# EAGLE design Amp-Rev1 (EAGLE 7.6.0)
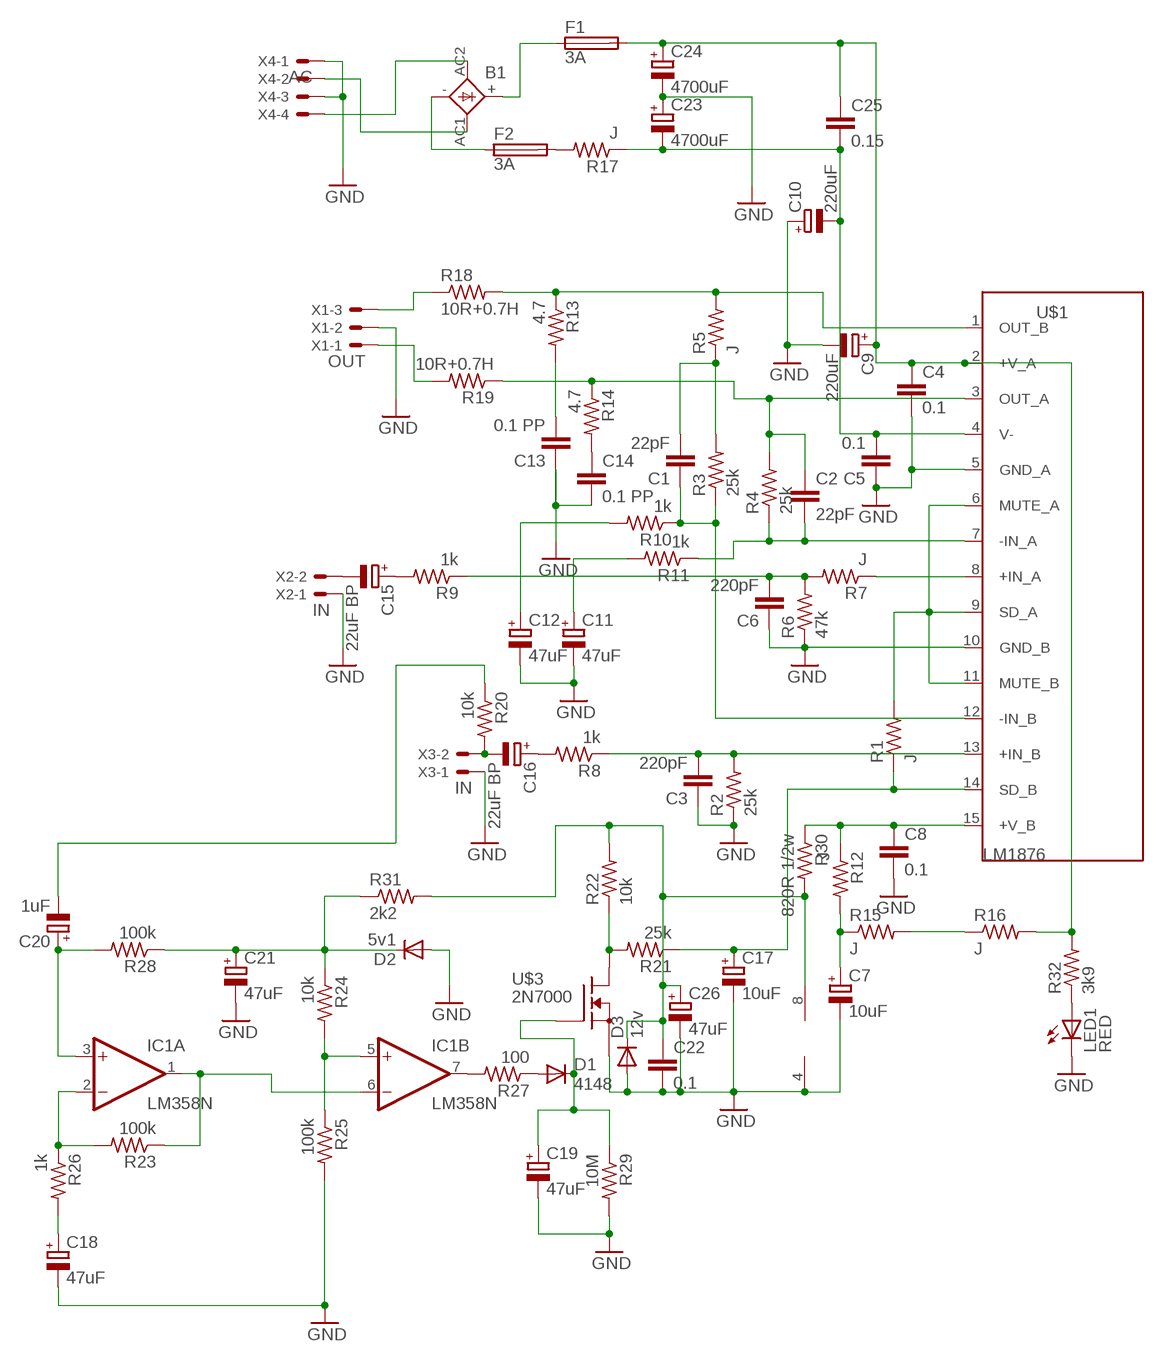
[diagram p0: schematic, sheet 1]

## Parts
B1  GBU4  [GBU4S]
C1  22pF  C-EU075-032X103  [C075-032X103]
C2  22pF  C-EU075-032X103  [C075-032X103]
C3  220pF  C-EUC1210  [C1210]
C4  0.1  C-EU050-025X075  [C050-025X075]
C5  0.1  C-EU050-025X075  [C050-025X075]
C6  220pF  C-EUC1210  [C1210]
C7  10uF  CPOL-EUE2.5-7  [E2,5-7]
C8  0.1  C-EU050-025X075  [C050-025X075]
C9  220uF  CPOL-EUE5-8.5  [E5-8,5]
C10  220uF  CPOL-EUE5-8.5  [E5-8,5]
C11  47uF  CPOL-EUE2.5-7  [E2,5-7]
C12  47uF  CPOL-EUE2.5-7  [E2,5-7]
C13  0.1 PP  C-EU050-055X075  [C050-055X075]
C14  0.1 PP  C-EU050-055X075  [C050-055X075]
C15  22uF BP  CPOL-EUE2.5-7  [E2,5-7]
C16  22uF BP  CPOL-EUE2.5-7  [E2,5-7]
C17  10uF  CPOL-EUE2.5-6  [E2,5-6]
C18  47uF  CPOL-EUE2.5-7  [E2,5-7]
C19  47uF  CPOL-EUE2.5-7  [E2,5-7]
C20  1uF  CPOL-EUE2.5-6  [E2,5-6]
C21  47uF  CPOL-EUE2.5-7  [E2,5-7]
C22  0.1  C-EUC1206  [C1206]
C23  4700uF  CPOL-EUE7.5-16  [E7,5-16]
C24  4700uF  CPOL-EUE7.5-16  [E7,5-16]
C25  0.15  C-EU075-032X103  [C075-032X103]
C26  47uF  CPOL-EUE2.5-7  [E2,5-7]
D1  4148  1N4148DO35-7  [DO35-7]
D2  5v1  1N4148DO35-10  [DO35-10]
D3  12v  1N4148DO35-10  [DO35-10]
F1  3A  19560  [19560]
F2  3A  19560  [19560]
IC1  LM358N  [DIL08]
LED1  RED  TLLR4400  [LED3MM]
R1  J  R-US_0207/12  [0207/12]
R2  25k  R-US_R1210  [R1210]
R3  25k  R-US_0207/10  [0207/10]
R4  25k  R-US_0207/10  [0207/10]
R5  J  R-US_0207/10  [0207/10]
R6  47k  R-US_M1206  [M1206]
R7  J  R-US_0204/7  [0204/7]
R8  1k  R-US_0207/10  [0207/10]
R9  1k  R-US_0207/12  [0207/12]
R10  1k  R-US_0204/7  [0204/7]
R11  1k  R-US_0207/10  [0207/10]
R12  J  R-US_0207/12  [0207/12]
R13  4.7  R-US_0207/12  [0207/12]
R14  4.7  R-US_0207/12  [0207/12]
R15  J  R-US_0207/12  [0207/12]
R16  J  R-US_0207/12  [0207/12]
R17  J  R-US_0207/10  [0207/10]
R18  10R+0.7H  R-US_0207/12  [0207/12]
R19  10R+0.7H  R-US_0207/12  [0207/12]
R20  10k  R-US_0204/7  [0204/7]
R21  25k  R-US_0204/7  [0204/7]
R22  10k  R-US_0204/7  [0204/7]
R23  100k  R-US_0204/5  [0204/5]
R24  10k  R-US_0207/10  [0207/10]
R25  100k  R-US_0204/5  [0204/5]
R26  1k  R-US_0207/10  [0207/10]
R27  100  R-US_0204/7  [0204/7]
R28  100k  R-US_0204/5  [0204/5]
R29  10M  R-US_0207/10  [0207/10]
R30  820R 1/2w  R-US_0207/10  [0207/10]
R31  2k2  R-US_0309/10  [0309/10]
R32  3k9  R-US_0207/10  [0207/10]
U$1  LM1876  [MULTIWATT-15]
U$3  2N7000  [TO92-]
X1  OUT  22-23-2031  [22-23-2031]
X2  IN  22-23-2021  [22-23-2021]
X3  IN  22-23-2021  [22-23-2021]
X4  AC  5566-4  [5566-4]

## Nets
GND: C3.1 C4.2 C5.1 C6.1 C7.- C8.2 C9.- C10.+ C11.- C12.- C13.1 C14.2 C17.- C18.- C19.- C21.- C22.2 C23.+ C24.- C26.- D2.A D3.A IC1.4(P:V-) LED1.K(C) R2.1 R6.1 R25.2 R29.2 U$1.5(GND_A) U$1.10(GND_B) U$3.3(S) X1.2 X2.1 X3.1 X4.1 X4.3
N$1: R7.1 U$1.8(+IN_A)
N$2: R1.2 U$1.6(MUTE_A) U$1.9(SD_A) U$1.11(MUTE_B)
N$3: C1.2 R3.2 R5.1
N$4: C6.2 R6.2 R7.2 R9.1
N$5: C2.2 R4.1 R11.1 U$1.7(-IN_A)
N$6: C5.2 C10.- C23.- C25.2 R17.1 U$1.4(V-)
N$7: C2.1 R4.2 R14.1 R19.1 U$1.3(OUT_A)
N$8: C4.1 C9.+ C24.+ C25.1 F1.2 R16.2 R32.2 U$1.2(+V_A)
N$9: R5.2 R13.1 R18.2 U$1.1(OUT_B)
N$10: C1.1 R3.1 R10.1 U$1.12(-IN_B)
N$11: R15.2 R16.1
N$12: C22.1 C26.+ D3.C IC1.8(P:V+) R22.2 R30.2 R31.2
N$13: C7.+ R12.2 R15.1
N$15: C17.+ R1.1 R21.1 U$1.14(SD_B)
N$17: C12.+ R10.2
N$18: C11.+ R11.2
N$19: C3.2 R2.2 R8.1 U$1.13(+IN_B)
N$21: C13.2 R13.2
N$22: C14.1 R14.2
N$23: R18.1 X1.3
N$24: R19.2 X1.1
N$25: C15.+ R9.2
N$26: C15.- X2.2
N$27: C20.- R20.1
N$28: C16.+ R8.2
N$29: C16.- R20.2 X3.2
N$30: LED1.A R32.1
N$31: C19.+ D1.C R29.1 U$3.2(G)
N$32: IC1.2(A:-IN) R23.2 R26.1
N$33: IC1.1(A:OUT) IC1.6(B:-IN) R23.1
N$34: C20.+ IC1.3(A:+IN) R28.2
N$35: IC1.5(B:+IN) R24.2 R25.1
N$36: C18.+ R26.2
N$37: C8.1 R12.1 R30.1 U$1.15(+V_B)
N$38: IC1.7(B:OUT) R27.2
N$39: C21.+ D2.C R24.1 R28.1 R31.1
N$40: R21.2 R22.1 U$3.1(D)
N$42: D1.A R27.1
N$46: B1.+ F1.1
N$47: F2.2 R17.2
N$48: B1.- F2.1
N$49: B1.AC1(AC2) X4.2
N$51: B1.AC2(AC1) X4.4

## Library data of the parts
B1 = rectifier:GBU4: GENERAL INSTRUMENT RECTIFIER
C1-C6 C8 C13 C14 C22 C25 = resistor:C-EU: CAPACITOR, European symbol
C7 C9-C12 C15-C21 C23 C24 C26 = resistor:CPOL-EU: POLARIZED CAPACITOR, European symbol
D1-D3 = diode:1N4148: DIODE high speed (Philips)
F1 F2 = fuse:19560: FUSE HOLDER TR5, Wickmann; MPN: 56000001009; OC_FARNELL: 1185363; OC_NEWARK: 15P8392
IC1 = linear:LM358: OP AMP also LM158; LM258; LM2904 Source: http://cache.national.com/ds/LM/LM158.pdf
LED1 = led:TLLR4400: Low Current (2mA) LED 3 mm Tinted Diffused Package color RED Source: Data sheet <http://www.farnell.com/datasheets/391100.pdf>; MF: VISHAY SEMICONDUCTOR; OC_FARNELL: 1612437
R1-R32 = resistor:R-US_: RESISTOR, American symbol
U$1 = st-microelectronics:LM1876: LM1876 2x15watt Audio Amplifer
U$3 = transistor-fet:2N7000
X1 = con-molex:22-23-2031: .100" (2.54mm) Center Header - 3 Pin; MF: MOLEX; MPN: 22-23-2031; OC_FARNELL: 1462950; OC_NEWARK: 30C0862
X2 X3 = con-molex:22-23-2021: .100" (2.54mm) Center Header - 2 Pin; MF: MOLEX; MPN: 22-23-2021; OC_FARNELL: 1462926; OC_NEWARK: 25C3832
X4 = con-molex:5566-4: Mini FIT connector 4 pol Source: http://www.molex.com; OC_FARNELL: unknown; OC_NEWARK: unknown

## Board
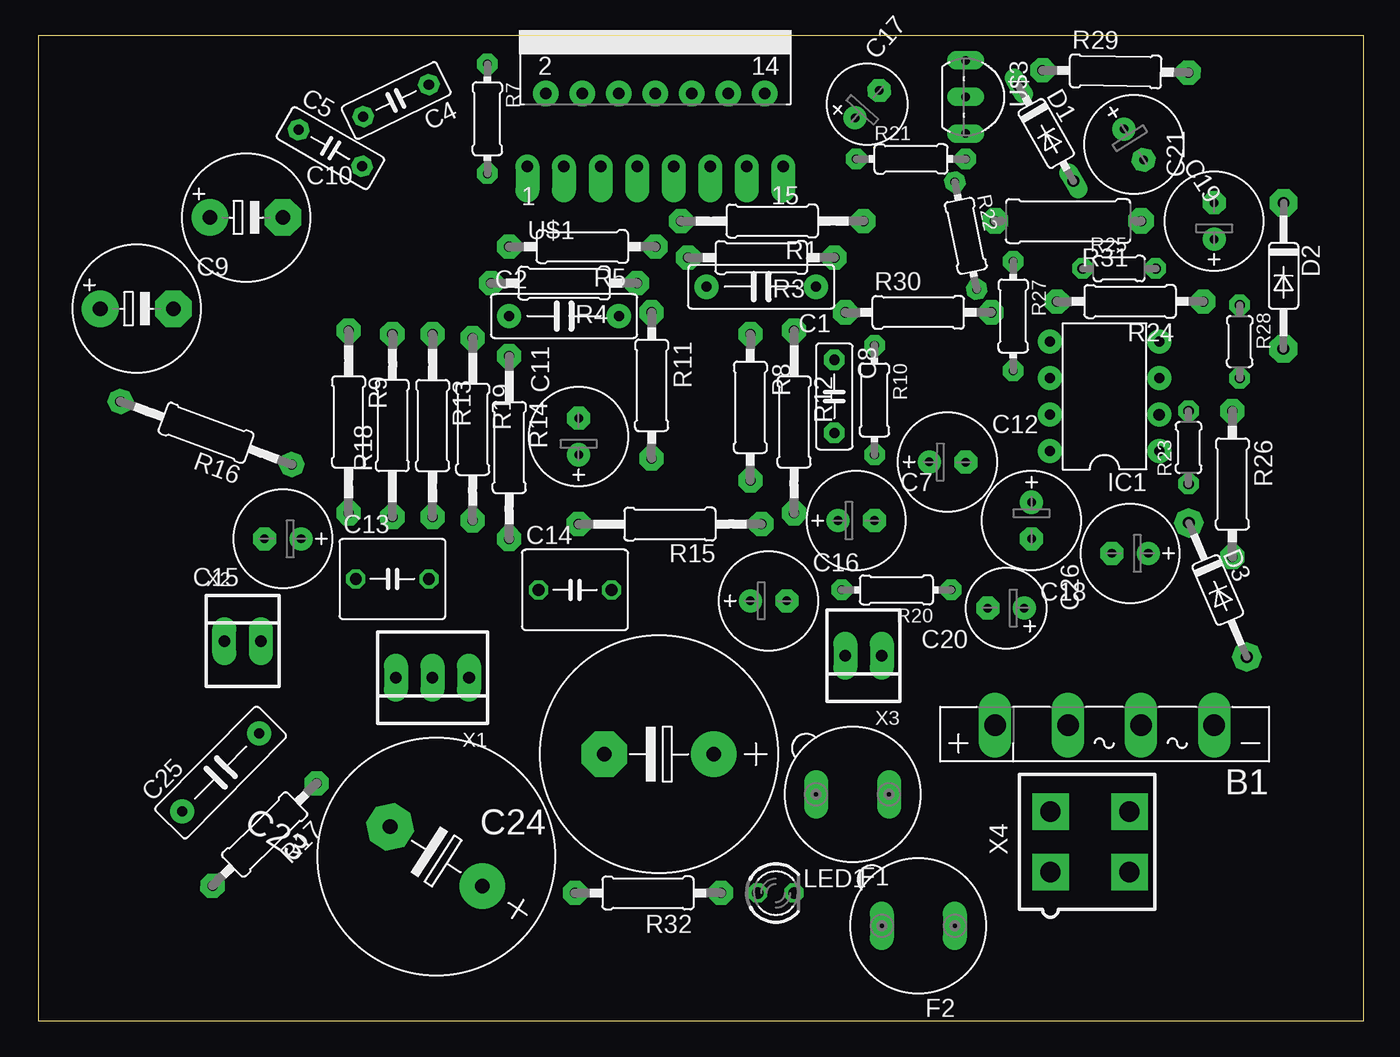
[diagram p1: board, top side]
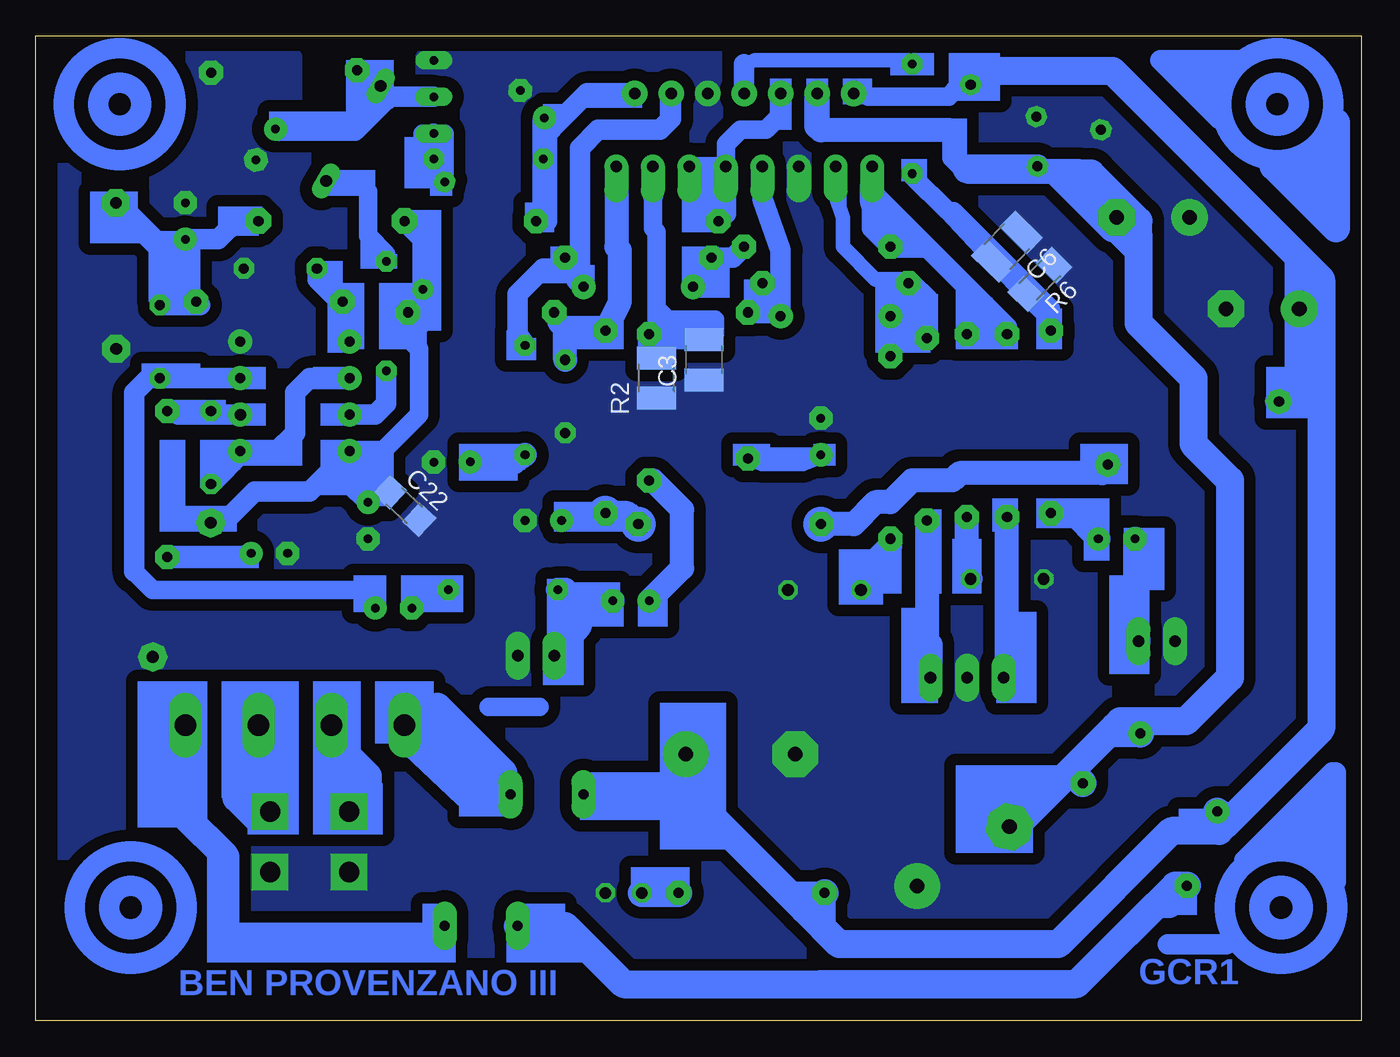
[diagram p2: board, bottom side, seen from below]

Size 92.18 x 68.5 mm. Coordinates in mm from the lower left corner, seen from the top.
Outline: 0,0 92.18,0 92.18,68.5 0,68.5 0,0
Copper layers (1*16): Top 0.035mm / dielectric 1.5mm / Bottom 0.035mm
Design rules "default": minimum track width 10mil, minimum drill 24mil, track to track 8mil, track to pad 8mil, pad to pad 8mil, via to via 8mil, smd to smd 8mil, copper to edge 40mil, drill to drill 8mil, minimum pad ring 10mil, minimum via ring 8mil, stop-mask expansion 4mil, vias tented up to drill 0mil, thermal gap 10mil

### Footprints (pad centres in the part's own frame; a part is rotated, then mirrored left to right if it is on the bottom)
GBU4S = drill 1.499 long: + 7.62,0; - -7.62,0; AC1 2.54,0; AC2 -2.54,0
C075-032X103 = drill 0.7 pad 1.676: 1 -3.81,0; 2 3.81,0
C1210 = smd 1.6 x 2.7: 1 -1.4,0; 2 1.4,0
C050-025X075 = drill 0.7 pad 1.422 octagon: 1 -2.54,0; 2 2.54,0
E2,5-7 = drill 0.6 pad 1.6: + -1.27,0 | drill 0.6 pad 1.6 octagon: - 1.27,0
E5-8,5 = drill 1.016 pad 2.54: + -2.54,0 | drill 1.016 pad 2.54 octagon: - 2.54,0
C050-055X075 = drill 0.813 octagon: 1 -2.54,0; 2 2.54,0
E2,5-6 = drill 0.6 pad 1.6: + -1.27,0 | drill 0.6 pad 1.6 octagon: - 1.27,0
C1206 = smd 1.6 x 1.8: 1 -1.4,0; 2 1.4,0
E7,5-16 = drill 1.016 pad 3.15: + -3.81,0 | drill 1.016 pad 3.15 octagon: - 3.81,0
DO35-7 = drill 0.813 long: A 3.81,0; C -3.81,0
DO35-10 = drill 0.813 pad 1.93 octagon: A 5.08,0; C -5.08,0
19560 = drill 0.7 pad 1.676 long: 1 -2.54,0; 2 2.54,0
DIL08 = drill 0.7 pad 1.676: 1 -3.81,-3.81; 3 1.27,-3.81; 4 3.81,-3.81; 5 3.81,3.81; 6 1.27,3.81; 7 -1.27,3.81; 8 -3.81,3.81 | drill 0.8 pad 1.676: 2 -1.27,-3.81
LED3MM = drill 0.813 octagon: A -1.27,0; K 1.27,0
0207/12 = drill 0.7 pad 1.676 octagon: 1 -6.35,0; 2 6.35,0
R1210 = smd 1.6 x 2.7: 1 -1.4,0; 2 1.4,0
0207/10 = drill 0.7 pad 1.676 octagon: 1 -5.08,0; 2 5.08,0
M1206 = smd 1.6 x 2: 1 -1.4,0; 2 1.4,0
0204/7 = drill 0.6 pad 1.422 octagon: 1 -3.81,0; 2 3.81,0
0204/5 = drill 0.7 pad 1.422 octagon: 1 -2.54,0; 2 2.54,0
0309/10 = drill 0.7 pad 1.778 octagon: 1 -5.08,0; 2 5.08,0
MULTIWATT-15 = drill 0.8 pad 1.676 offset: 1 -8.89,-7.62; 3 -6.35,-7.62; 5 -3.81,-7.62; 7 -1.27,-7.62; 9 1.27,-7.62; 11 3.81,-7.62; 13 6.35,-7.62; 15 8.89,-7.62 | drill 0.8 pad 1.778: 2 -7.62,-2.54; 4 -5.08,-2.54; 6 -2.54,-2.54; 8 0,-2.54; 10 2.54,-2.54; 12 5.08,-2.54; 14 7.62,-2.54
TO92- = drill 0.6 pad 1.27 long: 1 2.54,0; 2 0,0; 3 -2.54,0
22-23-2031 = drill 0.8 pad 1.676 long: 1 -2.54,0; 2 0,0; 3 2.54,0
22-23-2021 = drill 0.8 pad 1.676 long: 1 -1.27,0; 2 1.27,0
5566-4 = drill 1.4 pad 2.54 square: 1 2.1,-2.75; 2 -2.1,-2.75; 3 2.1,2.75; 4 -2.1,2.75

### Placement (x,y rotation side)
B1  74.17,20.57 180 top
C1  50.29,51.05 180 top
C2  36.58,49.02 0 top
C3  45.72,45.97 90 bottom
C4  24.89,64.01 206 top
C5  20.32,60.71 330.1 top
C6  24.64,53.85 225.5 bottom
C7  56.9,34.8 0 top
C8  55.37,43.43 270 top
C9  6.86,49.53 0 top
C10  14.48,55.88 0 top
C11  37.59,40.64 90 top
C12  63.25,38.86 359.6 top
C13  24.64,30.73 0 top
C14  37.34,29.97 0 top
C15  17.02,33.53 180 top
C16  50.8,29.21 0 top
C17  57.66,63.75 48.3 top
C18  75.95,32.51 180 top
C19  76.2,60.96 302.6 top
C20  67.31,28.7 180 top
C21  81.79,55.63 90 top
C22  66.55,35.81 316.9 bottom
C23  27.69,11.43 147.2 top
C24  43.18,18.54 180 top
C25  12.7,17.27 45.4 top
C26  69.09,34.8 270 top
D1  70.1,61.72 299.9 top
D2  86.61,51.82 269.9 top
D3  82.04,29.97 293.4 top
F1  56.64,15.75 180 top
F2  61.21,6.6 180 top
IC1  74.17,43.43 90 top
LED1  51.31,8.89 0 top
R1  51.05,55.63 180 top
R2  49.02,44.7 90 bottom
R3  50.29,53.09 180 top
R4  36.58,51.31 180 top
R5  37.85,53.85 180 top
R6  22.35,51.56 225.6 bottom
R7  31.24,62.74 270 top
R8  49.53,42.67 270 top
R9  21.59,41.66 270 top
R10  58.17,43.18 270 top
R11  42.67,44.2 270 top
R12  52.58,41.66 270 top
R13  27.43,41.4 270 top
R14  32.77,39.88 270 top
R15  43.94,34.54 180 top
R16  11.68,40.89 159.8 top
R17  15.75,12.95 224.5 top
R18  24.64,41.4 90 top
R19  30.23,41.15 270 top
R20  59.69,29.97 180 top
R21  60.71,59.94 0 top
R22  64.52,54.61 281.5 top
R23  80.01,39.88 90 top
R24  75.95,50.04 180 top
R25  75.18,52.32 0 top
R26  83.06,37.34 270 top
R27  67.82,49.02 270 top
R28  83.57,47.24 270 top
R29  74.93,66.04 359.1 top
R30  61.21,49.28 0 top
R31  71.63,55.63 180 top
R32  42.42,8.89 180 top
U$1  42.93,67.06 0 top
U$3  64.52,64.26 270 top
X1  27.43,23.88 180 top
X2  14.22,26.42 0 top
X3  57.4,25.4 180 top
X4  73.15,12.45 270 top

### Tracks (layer width: path | path; a pad name or v marks a point on that pad's centre or on a via)
GND
  pour Bottom (isolate 0.813, no thermals): 1.78,67.06 65.28,67.06 65.28,62.99 74.17,62.74 74.17,67.06 90.17,67.06 90.17,2.03 1.78,2.03
N$1
  Bottom 1.016: R7.1 31.5,66.8 42.16,66.8 42.93,66.55
  Bottom 1.422: 42.93,66.55 U$1.8
N$2
  Bottom 1.27: U$1.6 40.39,62.99 41.4,61.98 43.18,61.98 44.2,60.96 U$1.9 U$1.11
  Bottom 1.422: R1.2 44.2,56.13 U$1.9
N$3
  Bottom 1.422: R5.1 43.69,53.09 R3.2 C1.2
N$4
  Bottom 1.016: 23.57,50.8 23.62,50.8 25.62,52.8 C6.2
  Bottom 1.27: R9.1 21.84,49.02 23.62,50.8 28.76,56.31 | R6.2 22.3,49.53 21.59,49.53 28.37,56.31 28.76,56.31 | 28.76,56.31 31.24,58.79 R7.2
N$5
  Bottom 1.016: C2.2 41.02,49.66 42.29,49.66 | R4.1 41.19,50.84 41.19,50.76
  Bottom 1.27: R11.1 42.29,49.66 41.19,50.76
  Bottom 1.422: U$1.7 41.66,57.15 40.39,53.59 C2.2
N$6
  Bottom 1.422: C10.- 15.75,55.12 | 28.45,61.72 28.45,60.05 27.53,59.13 27.33,58.93 21.08,58.93
  Bottom 1.676: 21.08,58.93 19.81,58.93 19.18,58.29 16.51,55.63 | 27.53,59.13 27.69,59.44 C5.2 | 37.59,61.98 28.7,61.98 28.45,61.72
  Bottom 1.778: 37.59,61.98 37.85,62.23 U$1.4
  Bottom 1.93: 15.49,53.85 15.75,53.85 19.56,57.66 19.56,57.91 19.18,58.29 | 15.49,53.85 15.49,48.51 11.68,44.7 11.68,40.13 9.14,37.59 9.14,23.88 12.19,20.83 16.76,20.83 17.14,20.45 | 16.51,55.63 15.49,54.61 | 15.49,54.61 15.49,53.85 | 15.49,54.61 15.49,55.63 18.8,58.93 21.08,58.93 17.27,55.12 15.75,55.12 | 17.14,20.45 20.19,17.4 | 20.19,17.4 24.1,13.49 C23.- | R17.1 20.19,17.34 20.19,17.4 | C25.2 15.84,20.45 17.14,20.45
N$7
  Bottom 1.016: U$1.3 36.58,57.4 36.07,55.88 36.07,53.85 33.78,51.56 33.02,51.56 32.77,51.31 | C2.1 32.77,49.53 | 32.77,49.53 32.77,51.31 | R19.1 32.26,49.53 32.77,49.53 | R4.2 31.24,51.56 29.97,50.29 29.97,48.51 32.26,50.8 32.26,51.56 32.51,51.31 32.77,51.31
  Bottom 1.27: R14.1 C2.1
N$8
  Bottom 1.27: 27.69,65.53 28.7,64.26 34.29,64.26 34.54,64.52 U$1.2 | F1.2 53.47,15.37 46.35,15.37
  Bottom 1.676: 26.16,65.79 26.41,65.75 | 26.41,65.75 27.69,65.53 | 26.16,65.53 26.16,65.79 | 26.16,66.04 26.16,65.79 | 26.92,66.04 26.92,66.29 26.41,65.78 26.41,65.75
  Bottom 1.778: 27.69,65.53 C4.1
  Bottom 1.93: 2.79,49.53 2.79,51.56 17.29,66.06 17.38,66.06 17.4,66.04 26.16,66.04 | 2.79,49.53 2.79,43.43 | 2.79,43.43 2.79,20.32 9.27,13.84 | R16.2 5.38,43.43 2.79,43.43 | C9.+ 2.79,49.53 | 9.27,13.84 9.91,13.21 13.21,13.21 21.08,5.33 36.32,5.33 38.73,7.75 | 38.73,7.75 46.35,15.37 46.99,16 C24.+ | C25.1 9.31,13.84 9.27,13.84 | R32.2 38.48,7.75 38.73,7.75
N$9
  Bottom 1.422: U$1.1 34.04,58.17 | 34.04,56.9 34.04,55.12 R5.2 33.27,54.36 33.27,55.63 32.26,54.61 32.26,54.36 | R13.1 R18.2 24.64,48.26 33.78,57.4 34.04,57.4
  Bottom 1.676: 31.24,54.36 32.26,54.36 | 34.04,56.9 34.04,57.4 34.04,58.17
N$10
  Bottom 1.422: U$1.12 48.01,62.74 48.77,61.98 53.09,61.98 54.36,60.71 54.36,52.07 | 54.36,52.07 54.36,51.82 54.61,51.56 C1.1 | R3.1 54.61,52.32 | 54.61,52.32 54.36,52.07 | 54.61,52.32 56.9,52.32 58.67,50.55 58.67,47.75 R10.1
N$11
  Bottom 1.676: 37.08,34.54 R15.2 35.31,34.54 33.78,36.07 32.77,36.07 31.24,37.59 28.45,37.59 27.94,38.1 18.03,38.1 R16.1
N$12
  Bottom 1.27: 68.07,39.62 65.53,42.16 65.53,46.74 66.29,47.5 66.29,47.75 | 66.29,47.75 R30.2 | R22.2 65.28,48.51 66.04,47.75 66.29,47.75
  Bottom 1.422: IC1.8 68.07,39.62 | R22.2 65.28,54.36 R31.2 | IC1.8 73.15,36.83 76.96,36.83 77.98,35.81 78.9,34.89 D3.C | C26.+ 70.36,37.34 70.36,37.59 | 70.36,37.59 IC1.8 | C22.1 68.14,37.34 70.36,37.59
N$13
  Bottom 1.422: C7.+ R12.2
  Bottom 1.676: R15.1 51.05,35.31 R12.2
N$14
  Bottom 1.27: 44.96,47.75 44.96,48.77 48.51,48.77
N$15
  Bottom 1.422: U$1.14 53.85,64.52 55.75,62.61 | 55.75,62.61 56.64,61.72 56.64,59.94 | 56.64,59.94 56.64,55.63 R1.1 | C17.+ 55.86,62.61 55.75,62.61 | R21.1 56.64,59.94
N$16
  Bottom 1.27: 45.97,47.5 49.02,47.5 49.02,49.02
N$17
  Bottom 1.676: R10.2 58.93,38.86 C12.+
N$18
  Bottom 1.27: C11.+ 38.86,38.86 41.66,38.86 R11.2
N$19
  Bottom 1.27: 45.47,48.01 45.47,47.5 | 49.28,57.4 49.28,55.12 49.02,54.86 49.02,49.53 | 49.02,49.53 R2.2 | 45.47,47.5 45.72,47.5 45.72,48.26 R8.1 47.75,48.26 49.02,49.53 | 45.47,47.5 C3.2
  Bottom 1.422: U$1.13 49.28,57.4
N$20
  Bottom 1.422: 10.16,63.5 9.91,63.25 9.91,62.74 13.97,66.8 8.64,66.8
N$21
  Bottom 1.676: C13.2 27.43,30.99 R13.2
N$22
  Bottom 1.27: C14.1 34.8,31.24 33.02,33.02 32.77,33.02
  Bottom 1.676: 32.77,33.02 R14.2
N$23
  Bottom 1.676: X1.3 24.64,24.38 R18.1
N$24
  Bottom 1.676: R19.2 30.23,26.42 29.97,26.16 X1.1
N$25
  Bottom 1.676: C15.+ 20.07,35.31 R9.2
N$26
  Bottom 1.676: C15.- 15.75,27.94 X2.2
N$27
  Bottom 0.813: C20.- R20.1
N$28
  Bottom 1.676: C16.+ 47.24,31.5 47.24,35.56 49.28,37.59 R8.2
N$29
  Bottom 1.676: X3.2 54.36,27.43 54.61,29.21 | 54.61,29.21 55.37,29.97 R20.2 | C16.- 52.32,29.46 54.61,29.21
N$30
  Bottom 1.93: LED1.A R32.1
N$31
  Bottom 1.27: C19.+ 75.19,61.85 69.98,61.85 67.75,64.07
  Bottom 1.422: U$3.2 67.56,64.26 67.75,64.07 D1.C 69.53,64.07 R29.1
N$32
  Bottom 1.422: IC1.2 82.3,42.16 | 82.3,42.16 R26.1 | R23.2 82.3,42.16
N$33
  Bottom 1.422: IC1.6 73.15,44.7 74.17,43.69 74.17,40.89 75.44,39.62 77.72,39.62 | 77.72,39.62 IC1.1 | R23.1 77.72,39.62
N$34
  Bottom 1.27: 69.09,29.97 84.07,29.97 85.34,31.24
  Bottom 1.422: IC1.3 R28.2 84.33,44.7 85.34,43.69 85.34,31.24 | C20.+ 69.09,29.97
N$35
  Bottom 1.27: R25.1 72.64,51.56 71.12,50.04 R24.2
  Bottom 1.422: IC1.5 R24.2
N$36
  Bottom 1.422: C18.+ 77.72,32.26 R26.2
N$37
  Bottom 1.422: 55.37,48.01 55.88,48.51 R30.1
  Bottom 1.676: U$1.15 51.82,53.85 51.56,53.59 51.56,50.04 R12.1 55.37,48.01 C8.1
N$38
  Bottom 1.422: IC1.7 68.58,42.16 67.82,42.93 R27.2
N$39
  Bottom 1.422: R28.1 80.77,49.78 R24.1 81.79,51.31 C21.+ 79.5,54.36 78.23,55.63 R31.1
  Bottom 1.676: C21.+ 82.04,54.1 83.82,54.1 86.7,56.98 D2.C
N$40
  Bottom 1.27: 64.52,59.69 R21.2 | R22.1 63.75,59.94 | 63.75,59.94 63.75,61.72 | 63.75,59.94 64.13,60.33 | 64.13,60.33 65.28,61.47 65.28,61.72 | U$3.1 64.13,61.34 64.13,60.33
  Bottom 1.422: R21.2 U$3.1
N$41
  Bottom 1.93: 1.78,62.48 1.78,55.12 6.1,59.44 2.79,59.44 2.54,59.18 2.54,57.91 3.56,57.91 3.81,58.17
N$42
  Bottom 1.27: D1.A 69.85,58.42 69.09,57.66 69.09,54.61 67.82,53.34 R27.1
N$44
  Bottom 1.27: 57.15,21.84 60.71,21.84
N$45
  Bottom 1.93: 12.19,9.4 12.95,9.4 19.81,2.54 37.59,2.54
N$46
  Bottom 1.27: 62.23,15.75 F1.1
  Bottom 1.93: 62.23,15.75 66.55,19.81 B1.+
N$47
  Bottom 1.93: F2.2 55.37,6.6 51.31,2.54 19.81,2.54 14.22,8.13 13.39,8.13 R17.2
N$48
  Bottom 1.27: F2.1 64.52,5.84 65.02,5.84
  Bottom 1.93: 65.02,5.84 78.99,5.84 78.99,11.43 81.79,14.22 B1.-
N$49
  Bottom 1.93: X4.2 70.36,14.59 70.36,17.27 71.63,18.54 B1.AC1
N$50
  Bottom 1.93: 75.95,13.97 76.71,13.97 78.23,15.49 78.23,17.02
N$51
  Bottom 1.93: X4.4 76.2,14.84 76.2,17.02 76.71,17.53 B1.AC2
N$52
  Bottom 1.93: 66.55,20.83 66.55,21.59 66.29,21.84 64.26,21.84 59.69,17.27 61.98,17.27 65.02,20.32
N$53
  Bottom 1.93: 70.1,14.73 70.1,15.24 69.09,16.26 69.09,17.02 70.36,18.29
N$54
  Bottom 1.422: 1.78,9.65 1.78,17.27 2.03,17.27 8.13,11.18 7.87,11.18
N$55
  Bottom 1.422: 2.54,11.43 2.54,14.99 2.79,15.24 2.79,14.99 5.33,12.45 3.56,12.45 3.3,12.19 3.3,12.95 3.56,13.21
N$56
  Bottom 1.422: 9.4,5.33 13.46,5.33
N$57
  Bottom 1.422: 10.16,66.29 11.68,66.29 11.94,66.04 11.94,65.79 10.92,64.77 10.67,64.77 10.16,65.28
(copper drawn outside any net)
  shapes: Bottom area x270, Bottom circle x11

### Text on the board
Bottom: GCR1 | BEN PROVENZANO III